# EAGLE design display gender changer (EAGLE 6.0)
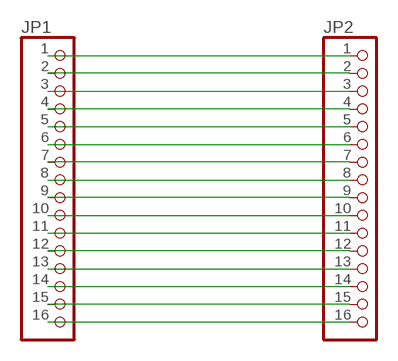
[diagram p0: schematic, sheet 1]

## Parts
JP1  PINHD-1X16  [1X16]
JP2  PINHD-1X16  [1X16]

## Nets
N$17: JP1.1 JP2.1
N$18: JP1.2 JP2.2
N$19: JP1.3 JP2.3
N$20: JP1.4 JP2.4
N$21: JP1.5 JP2.5
N$22: JP1.6 JP2.6
N$23: JP1.7 JP2.7
N$24: JP1.8 JP2.8
N$25: JP1.9 JP2.9
N$26: JP1.10 JP2.10
N$27: JP1.11 JP2.11
N$28: JP1.12 JP2.12
N$29: JP1.13 JP2.13
N$30: JP1.14 JP2.14
N$31: JP1.15 JP2.15
N$32: JP1.16 JP2.16

## Library data of the parts
JP1 JP2 = pinhead:PINHD-1X16: PIN HEADER

## Board
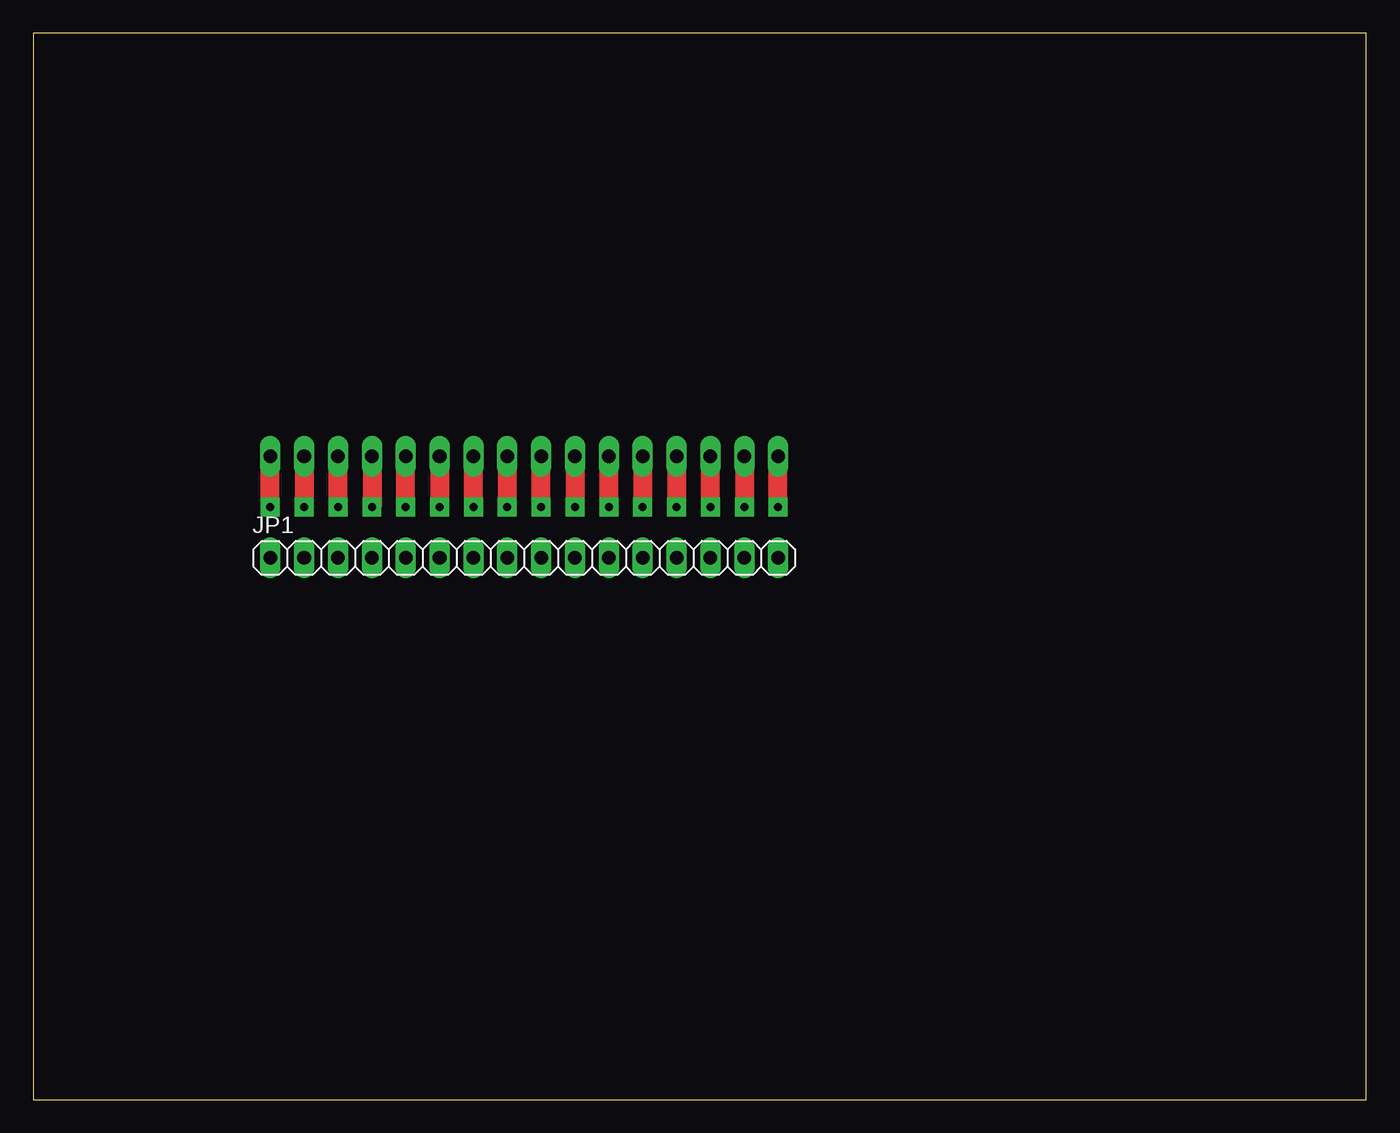
[diagram p1: board, top side]
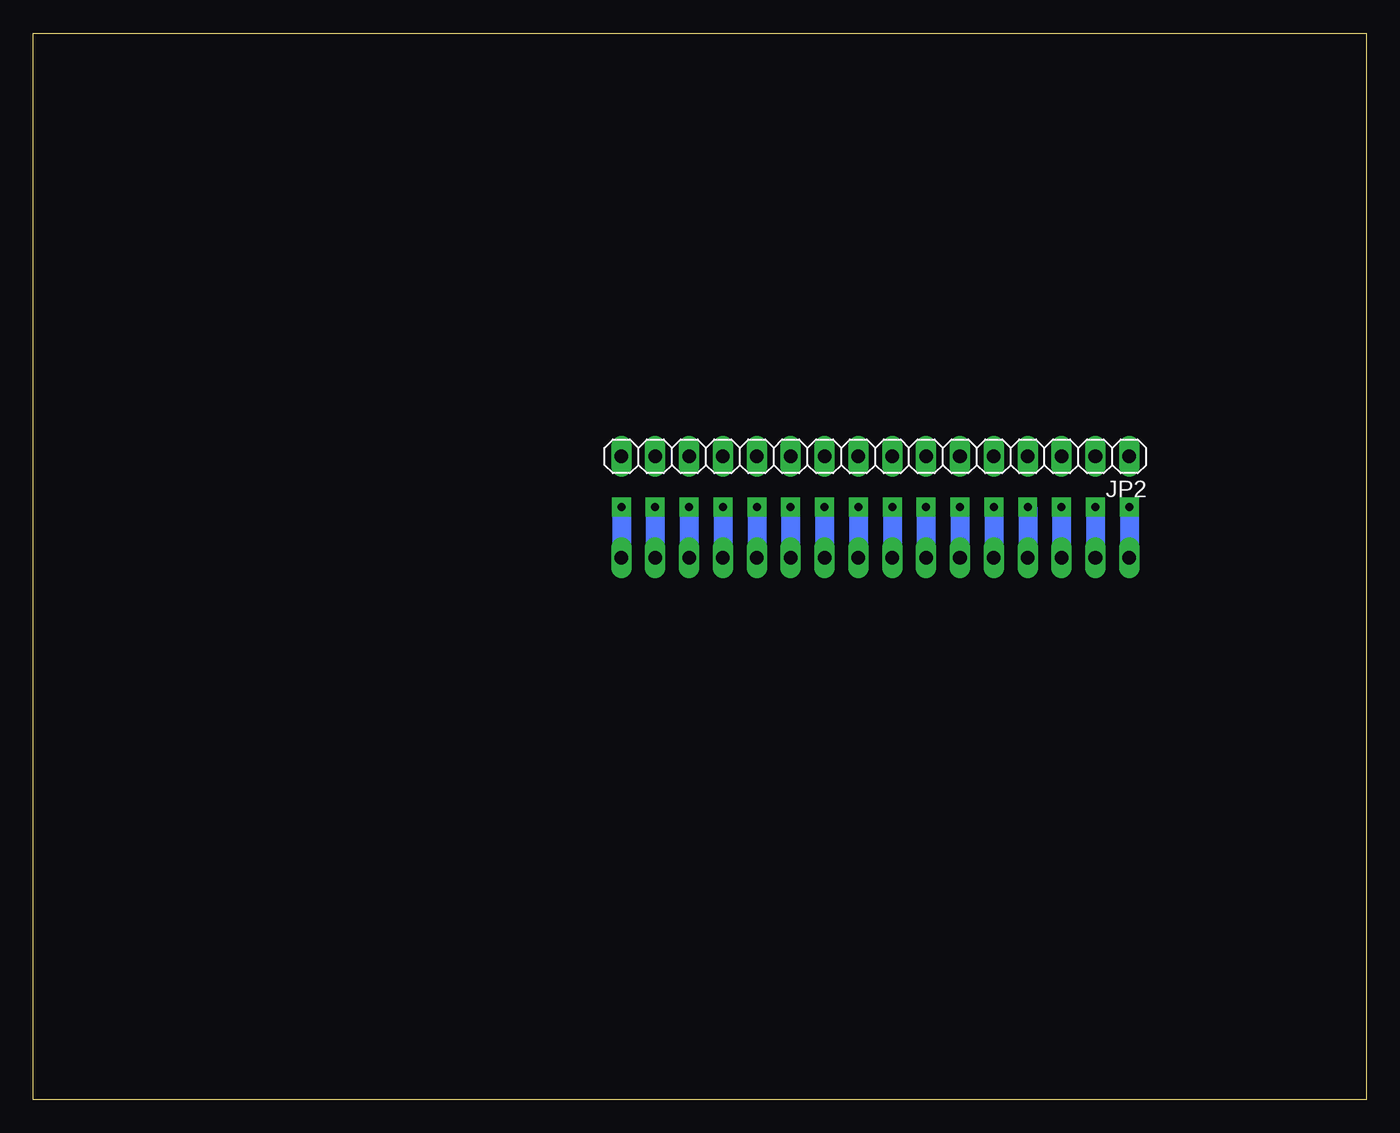
[diagram p2: board, bottom side, seen from below]

Size 100 x 80 mm. Coordinates in mm from the lower left corner, seen from the top.
Outline: 0,0 100,0 100,80 0,80 0,0
Copper layers (1*16): Top 0.035mm / dielectric 1.5mm / Bottom 0.035mm
Design rules: minimum track width 10mil, minimum drill 24mil, track to track 8mil, track to pad 8mil, pad to pad 8mil, via to via 8mil, smd to smd 8mil, copper to edge 40mil, drill to drill 8mil, minimum pad ring 10mil, minimum via ring 8mil, stop-mask expansion 4mil, vias tented up to drill 0mil, thermal gap 10mil

### Footprints (pad centres in the part's own frame; a part is rotated, then mirrored left to right if it is on the bottom)
1X16 = drill 1.016 long: 1 -19.05,0; 2 -16.51,0; 3 -13.97,0; 4 -11.43,0; 5 -8.89,0; 6 -6.35,0; 7 -3.81,0; 8 -1.27,0; 9 1.27,0; 10 3.81,0; 11 6.35,0; 12 8.89,0; 13 11.43,0; 14 13.97,0; 15 16.51,0; 16 19.05,0

### Placement (x,y rotation side)
JP1  36.83,40.64 0 top
JP2  36.83,48.26 180 bottom

### Tracks (layer width: path | path; a pad name or v marks a point on that pad's centre or on a via)
N$17  (via drill 0.6 pad 1.42)
  Top 1.422: v17.78,44.45 JP2.1
  Bottom 1.422: v17.78,44.45 JP1.1
N$18  (via drill 0.6 pad 1.42)
  Top 1.422: JP2.2 v20.32,44.45
  Bottom 1.422: v20.32,44.45 JP1.2
N$19  (via drill 0.6 pad 1.42)
  Top 1.422: v22.86,44.45 JP2.3
  Bottom 1.422: v22.86,44.45 JP1.3
N$20  (via drill 0.6 pad 1.42)
  Top 1.422: JP2.4 v25.4,44.45
  Bottom 1.422: v25.4,44.45 JP1.4
N$21  (via drill 0.6 pad 1.42)
  Top 1.422: v27.94,44.45 JP2.5
  Bottom 1.422: v27.94,44.45 JP1.5
N$22  (via drill 0.6 pad 1.42)
  Top 1.422: JP2.6 v30.48,44.45
  Bottom 1.422: v30.48,44.45 JP1.6
N$23  (via drill 0.6 pad 1.42)
  Top 1.422: v33.02,44.45 JP2.7
  Bottom 1.422: v33.02,44.45 JP1.7
N$24  (via drill 0.6 pad 1.42)
  Top 1.422: JP2.8 v35.56,44.45
  Bottom 1.422: v35.56,44.45 JP1.8
N$25  (via drill 0.6 pad 1.42)
  Top 1.422: v38.1,44.45 JP2.9
  Bottom 1.422: v38.1,44.45 JP1.9
N$26  (via drill 0.6 pad 1.42)
  Top 1.422: JP2.10 v40.64,44.45
  Bottom 1.422: v40.64,44.45 JP1.10
N$27  (via drill 0.6 pad 1.42)
  Top 1.422: v43.18,44.45 JP2.11
  Bottom 1.422: v43.18,44.45 JP1.11
N$28  (via drill 0.6 pad 1.42)
  Top 1.422: JP2.12 v45.72,44.45
  Bottom 1.422: v45.72,44.45 JP1.12
N$29  (via drill 0.6 pad 1.42)
  Top 1.422: JP2.13 v48.26,44.45
  Bottom 1.422: v48.26,44.45 JP1.13
N$30  (via drill 0.6 pad 1.42)
  Top 1.422: v50.8,44.45 JP2.14
  Bottom 1.422: v50.8,44.45 JP1.14
N$31  (via drill 0.6 pad 1.42)
  Top 1.422: JP2.15 v53.34,44.45
  Bottom 1.422: v53.34,44.45 JP1.15
N$32  (via drill 0.6 pad 1.42)
  Top 1.422: v55.88,44.45 JP2.16
  Bottom 1.422: v55.88,44.45 JP1.16